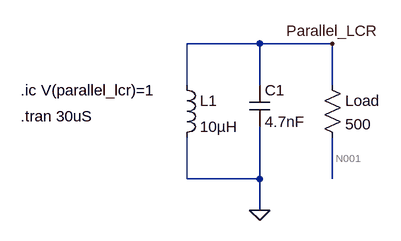
[diagram p0: schematic LC Resonator.asc]
LC Resonator.asc, the LTspice schematic file:
Version 4
SHEET 1 880 680
WIRE 224 48 112 48
WIRE 336 48 224 48
WIRE 112 112 112 48
WIRE 224 112 224 48
WIRE 336 112 336 48
WIRE 112 256 112 192
WIRE 224 256 224 176
WIRE 224 256 112 256
WIRE 336 256 336 192
WIRE 224 304 224 256
FLAG 224 304 0
FLAG 336 48 Parallel_LCR
SYMBOL ind 96 96 R0
SYMATTR InstName L1
SYMATTR Value 10µH
SYMBOL cap 208 112 R0
SYMATTR InstName C1
SYMATTR Value 4.7nF
SYMBOL res 320 96 R0
SYMATTR InstName Load
SYMATTR Value 500
TEXT -144 120 Left 2 !.ic V(parallel_lcr)=1
TEXT -144 160 Left 2 !.tran 30uS

The netlist it stands for:
* LC Resonator.asc
L1 Parallel_LCR 0 10µH
C1 Parallel_LCR 0 4.7nF
R§Load Parallel_LCR N001 500
.ic V(parallel_lcr)=1
.tran 30uS
.backanno
.end

* Results of the author's LTspice run, read from the files saved beside the schematic
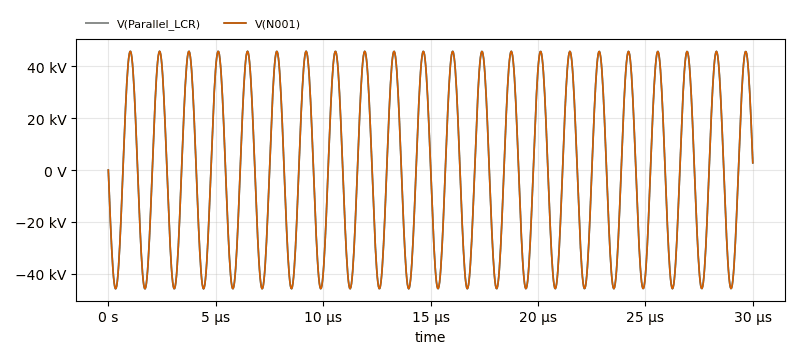
[diagram p1: Transient Analysis of LC Resonator.asc, plotted from the saved traces]
* Transient Analysis, 1 run:
*   V(Parallel_LCR): min -45.91 kV, max 45.9 kV, average -1.206 V, rms 32.45 kV, last 2.768 kV
*   V(N001): min -45.91 kV, max 45.9 kV, average -1.206 V, rms 32.45 kV, last 2.768 kV